# Altium schematic sheet JacdacBreadboardBc30Mount 134.SchDoc: Complete design
size A4; DocumentNumber: 1; SheetNumber: 1; SheetTotal: 1; VersionControl_RevNumber: 1
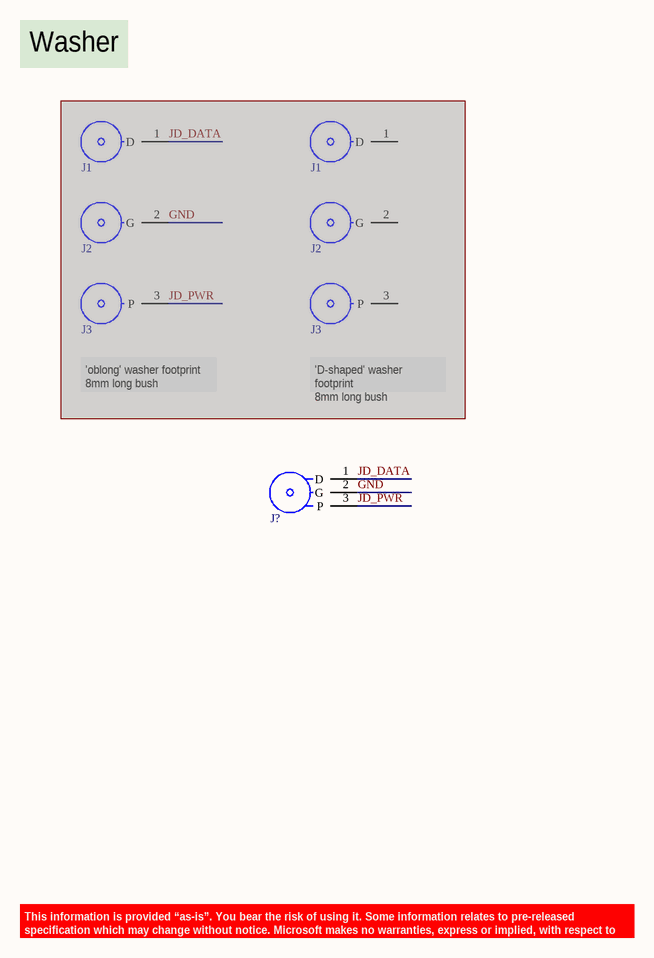
[diagram p0: JacdacBreadboardBc30Mount 134.SchDoc]

## Parts
(Parts that share a designator on the sheet are numbered #1, #2 ... from top to bottom, then left to right.)
J1#1  Jacdac breadboard washer JD_DATA  [Jacdac_breadboard_transition_hole_rings_pin1_v5-PTH-OBLONG]  (value not drawn)  (masked out: inside a compile mask, not in the netlist)
J1#2  Jacdac breadboard washer JD_DATA  [Jacdac_breadboard_transition_hole_rings_pin1_v5-PTH]  (value not drawn)  (masked out: inside a compile mask, not in the netlist)
J2#1  Jacdac breadboard washer GND  [Jacdac_breadboard_transition_hole_rings_pin2_v5-JLC-OBLONG]  (value not drawn)  (masked out: inside a compile mask, not in the netlist)
J2#2  Jacdac breadboard washer GND  [Jacdac_breadboard_transition_hole_rings_pin2_v5-JLC]  (value not drawn)  (masked out: inside a compile mask, not in the netlist)
J3#1  Jacdac breadboard washer JD_PWR  [Jacdac_breadboard_transition_hole_rings_pin3_v5-JLC-OBLONG]  (value not drawn)  (masked out: inside a compile mask, not in the netlist)
J3#2  Jacdac breadboard washer JD_PWR  [Jacdac_breadboard_transition_hole_rings_pin3_v5-JLC]  (value not drawn)  (masked out: inside a compile mask, not in the netlist)
J?  Jacdac breadboard double washer all signals  [Jacdac_breadboard_transition_hole_rings_BC30]  (value not drawn)

## Nets
GND: J?.2(G)
JD_DATA: J?.1(D)
JD_PWR: J?.3(P)

## Notes on the sheet
- Washer
- 'oblong' washer footprint
  8mm long bush
- 'D-shaped' washer footprint
  8mm long bush
- This information is provided “as-is”. You bear the risk of using it. Some information relates to pre-released specification which may change without notice. Microsoft makes no warranties, express or implied, with respect to the information provided here.
- PROJECT FILENAME
- PROJECT CODENAME
- Microsoft
- PROJECT DESCRIPTION
- SHEET DESCRIPTION
- SHEET FILENAME
- LICENCE
- LAST MODIFIED
- PAGE
- OF
- DRAWN BY
- REVISION
- PCB ID

## Library data of the parts
J1#1 J1#2 = Jacdac breadboard washer JD_DATA: Manufacturer Part Number 1: SMTSM3080; Manufacturer 1: Sinhoo; Hole Size: M3; Hole Clearance: 7.0mm; Supplier 1: LCSC; Supplier Part Number 1: C2916369; ComponentLink1Description: Online datasheet; ComponentLink1URL: https://datasheet.lcsc.com/lcsc/2111221830_Sinhoo-SMTSO3080CTJ_C2916369.pdf
J2#1 J2#2 = Jacdac breadboard washer GND: Manufacturer 1: Sinhoo; Manufacturer Part Number 1: SMTSO3080; Hole Size: M3; Hole Clearance: 7.0mm; Supplier 1: LCSC; Supplier Part Number 1: C2916369; ComponentLink1Description: Online datasheet; ComponentLink1URL: https://datasheet.lcsc.com/lcsc/2111221830_Sinhoo-SMTSO3080CTJ_C2916369.pdf
J3#1 J3#2 = Jacdac breadboard washer JD_PWR: Manufacturer Part Number 1: SMTSO3080; Manufacturer 1: Sinhoo; Hole Size: M3; Hole Clearance: 7.0mm; Supplier Part Number 1: C2916369; Supplier 1: LCSC; ComponentLink1Description: Online datasheet; ComponentLink1URL: https://datasheet.lcsc.com/lcsc/2111221830_Sinhoo-SMTSO3080CTJ_C2916369.pdf
J? = Jacdac breadboard double washer all signals: Hole Size: M3; Hole Clearance: 7.0mm